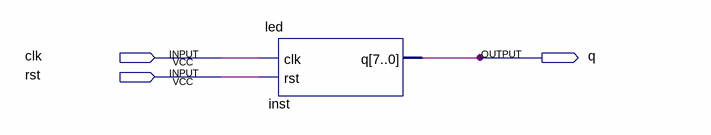
[diagram p0: schematic sheet]
// Quartus schematic Block1.bdf as structural Verilog: 1 symbols, 3 pins
module Block1 (
  input  clk,
  input  rst,
  output q
);

  led inst (.clk(clk), .rst(rst), .q(q));
endmodule
